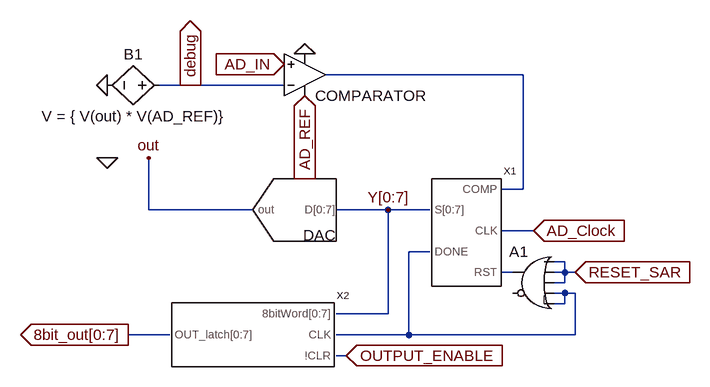
[diagram p0: schematic SAR.asc]
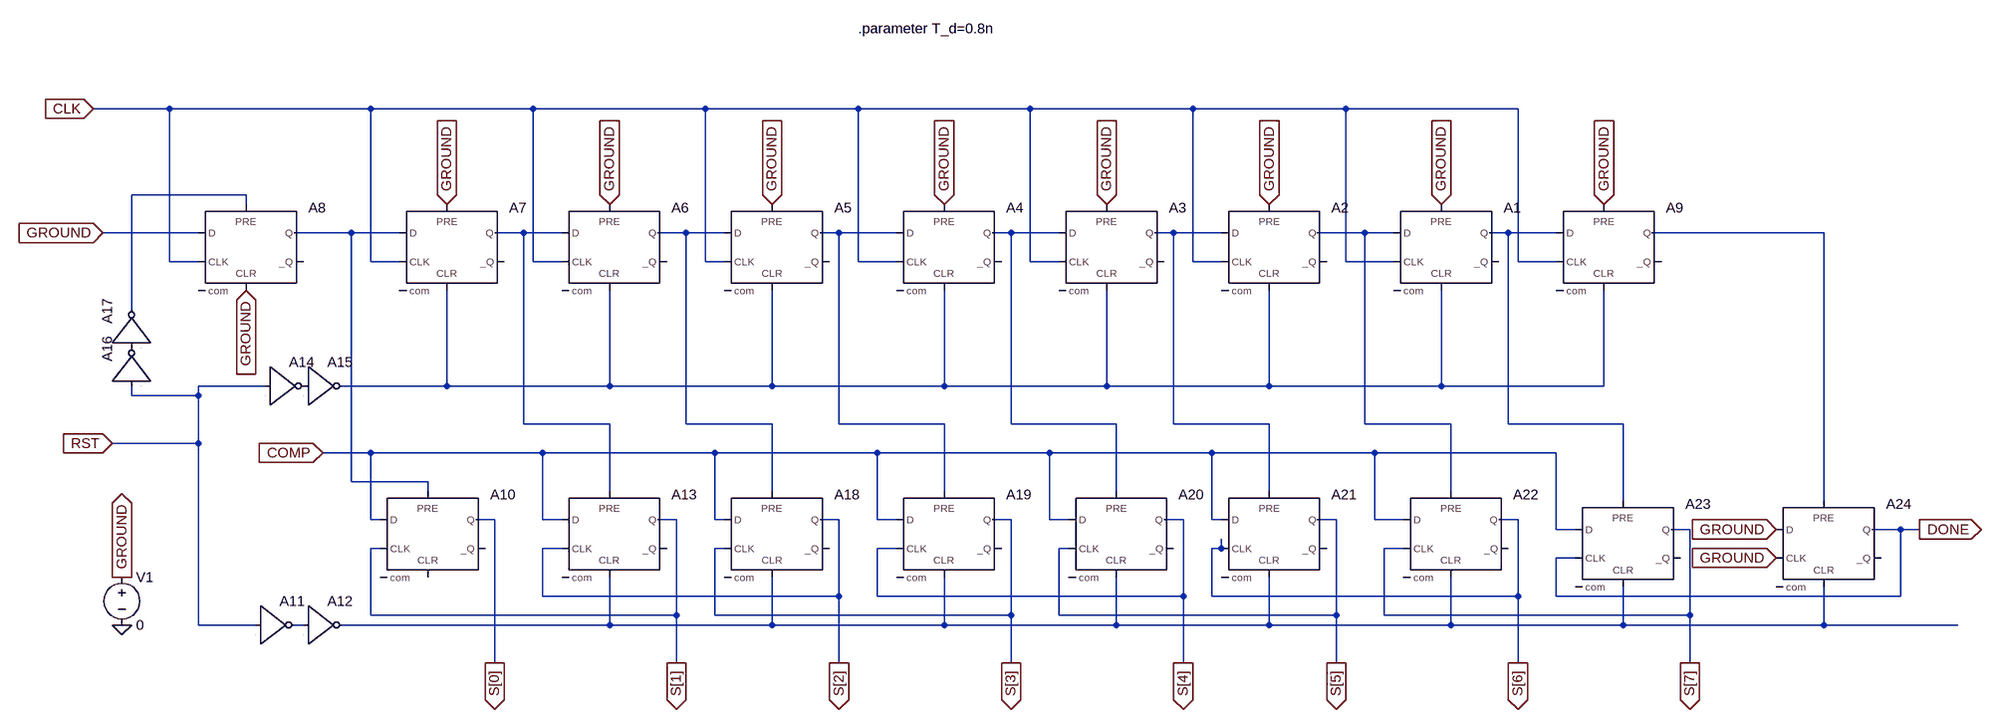
[diagram p1: sub-circuit sar_logic.asc]
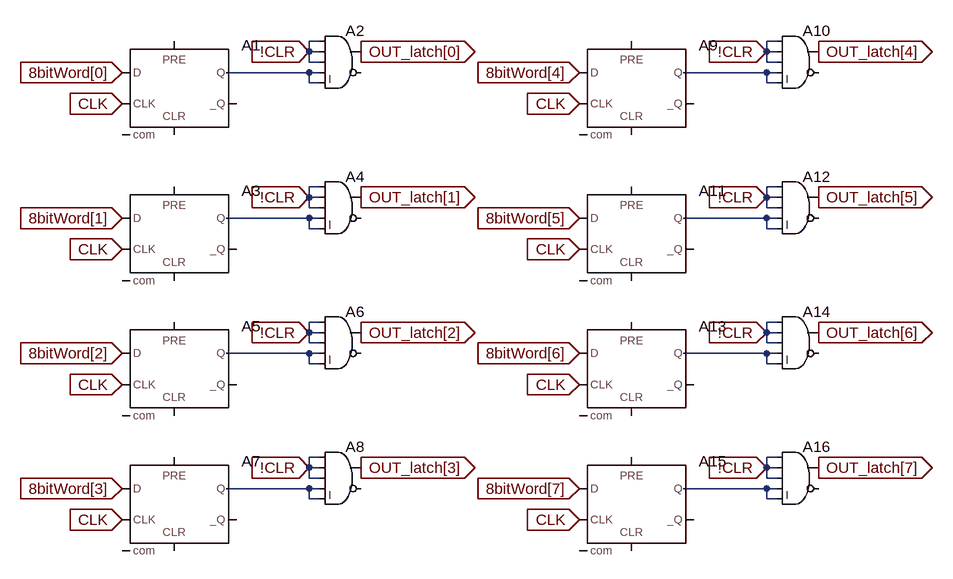
[diagram p2: sub-circuit latch_8bit.asc]
SAR.asc, the LTspice schematic file:
Version 4
SHEET 1 880 680
WIRE -176 -112 -480 -112
WIRE -688 -96 -736 -96
WIRE -544 -96 -688 -96
WIRE -176 64 -176 -112
WIRE -176 64 -208 64
WIRE -752 96 -752 16
WIRE -592 96 -752 96
WIRE -384 96 -464 96
WIRE -320 96 -384 96
WIRE -160 128 -208 128
WIRE -320 160 -352 160
WIRE -112 176 -128 176
WIRE -192 192 -208 192
WIRE -112 192 -112 176
WIRE -112 192 -128 192
WIRE -96 192 -112 192
WIRE -112 208 -112 192
WIRE -112 208 -128 208
WIRE -112 224 -128 224
WIRE -96 224 -112 224
WIRE -112 240 -112 224
WIRE -112 240 -128 240
WIRE -384 256 -384 96
WIRE -384 256 -464 256
WIRE -720 288 -784 288
WIRE -352 288 -352 160
WIRE -352 288 -464 288
WIRE -96 288 -96 224
WIRE -96 288 -352 288
WIRE -448 320 -464 320
FLAG -544 -128 AD_IN
IOPIN -544 -128 In
FLAG -512 -144 0
FLAG -512 -80 AD_REF
IOPIN -512 -80 In
FLAG -384 96 Y[0:7]
FLAG -784 288 8bit_out[0:7]
IOPIN -784 288 Out
FLAG -448 320 OUTPUT_ENABLE
IOPIN -448 320 In
FLAG -160 128 AD_Clock
IOPIN -160 128 In
FLAG -96 192 RESET_SAR
IOPIN -96 192 In
FLAG -688 -96 debug
IOPIN -688 -96 Out
FLAG -816 -96 0
FLAG -752 16 out
FLAG -816 16 0
SYMBOL Opamps\\UniversalOpamp2 -512 -112 M180
SYMATTR InstName COMPARATOR
SYMBOL DAC8 -528 96 R180
SYMATTR InstName DAC
SYMATTR SpiceModel DAC8
SYMBOL SAR_LOGIC -256 128 R0
SYMATTR InstName X1
SYMBOL Latch_8bit -576 288 R0
SYMATTR InstName X2
SYMBOL bv -720 -96 R90
WINDOW 0 -32 56 VBottom 2
WINDOW 3 32 56 VTop 2
SYMATTR InstName B1
SYMATTR Value V = { V(out) * V(AD_REF)}
SYMBOL Digital\\or -160 144 M0
SYMATTR InstName A1

sar_logic.asc, the sub-circuit schematic file:
Version 4
SHEET 1 1752 752
WIRE -1664 -368 -1792 -368
WIRE -1328 -368 -1664 -368
WIRE -1056 -368 -1328 -368
WIRE -768 -368 -1056 -368
WIRE -512 -368 -768 -368
WIRE -224 -368 -512 -368
WIRE 48 -368 -224 -368
WIRE 304 -368 48 -368
WIRE 592 -368 304 -368
WIRE -1536 -224 -1728 -224
WIRE -1536 -208 -1536 -224
WIRE -1616 -160 -1776 -160
WIRE -1360 -160 -1456 -160
WIRE -1280 -160 -1360 -160
WIRE -1072 -160 -1120 -160
WIRE -1008 -160 -1072 -160
WIRE -800 -160 -848 -160
WIRE -736 -160 -800 -160
WIRE -544 -160 -576 -160
WIRE -448 -160 -544 -160
WIRE -256 -160 -288 -160
WIRE -176 -160 -256 -160
WIRE 16 -160 -16 -160
WIRE 96 -160 16 -160
WIRE 336 -160 256 -160
WIRE 384 -160 336 -160
WIRE 576 -160 544 -160
WIRE 656 -160 576 -160
WIRE 1104 -160 816 -160
WIRE -1664 -112 -1664 -368
WIRE -1616 -112 -1664 -112
WIRE -1328 -112 -1328 -368
WIRE -1280 -112 -1328 -112
WIRE -1056 -112 -1056 -368
WIRE -1008 -112 -1056 -112
WIRE -768 -112 -768 -368
WIRE -736 -112 -768 -112
WIRE -512 -112 -512 -368
WIRE -448 -112 -512 -112
WIRE -224 -112 -224 -368
WIRE -176 -112 -224 -112
WIRE 48 -112 48 -368
WIRE 96 -112 48 -112
WIRE 304 -112 304 -368
WIRE 384 -112 304 -112
WIRE 592 -112 592 -368
WIRE 656 -112 592 -112
WIRE -1728 -32 -1728 -224
WIRE -1504 96 -1616 96
WIRE -1200 96 -1200 -64
WIRE -1200 96 -1376 96
WIRE -928 96 -928 -64
WIRE -928 96 -1200 96
WIRE -656 96 -656 -64
WIRE -656 96 -928 96
WIRE -368 96 -368 -64
WIRE -368 96 -656 96
WIRE -96 96 -96 -64
WIRE -96 96 -368 96
WIRE 176 96 176 -64
WIRE 176 96 -96 96
WIRE 464 96 464 -64
WIRE 464 96 176 96
WIRE 736 96 736 -64
WIRE 736 96 464 96
WIRE -1728 112 -1728 96
WIRE -1616 112 -1616 96
WIRE -1616 112 -1728 112
WIRE -1072 160 -1072 -160
WIRE -928 160 -1072 160
WIRE -800 160 -800 -160
WIRE -656 160 -800 160
WIRE -544 160 -544 -160
WIRE -368 160 -544 160
WIRE -256 160 -256 -160
WIRE -80 160 -256 160
WIRE 16 160 16 -160
WIRE 176 160 16 160
WIRE 336 160 336 -160
WIRE 480 160 336 160
WIRE 576 160 576 -160
WIRE 768 160 576 160
WIRE -1616 192 -1616 112
WIRE -1616 192 -1760 192
WIRE -1328 208 -1408 208
WIRE -1040 208 -1328 208
WIRE -752 208 -1040 208
WIRE -480 208 -752 208
WIRE -192 208 -480 208
WIRE 80 208 -192 208
WIRE 352 208 80 208
WIRE 656 208 352 208
WIRE -1360 256 -1360 -160
WIRE -1232 256 -1360 256
WIRE -1232 272 -1232 256
WIRE -928 272 -928 160
WIRE -656 272 -656 160
WIRE -368 272 -368 160
WIRE -80 272 -80 160
WIRE 176 272 176 160
WIRE 480 272 480 160
WIRE 768 288 768 160
WIRE 1104 288 1104 -160
WIRE -1328 320 -1328 208
WIRE -1312 320 -1328 320
WIRE -1120 320 -1152 320
WIRE -1040 320 -1040 208
WIRE -1008 320 -1040 320
WIRE -816 320 -848 320
WIRE -752 320 -752 208
WIRE -736 320 -752 320
WIRE -544 320 -576 320
WIRE -480 320 -480 208
WIRE -448 320 -480 320
WIRE -256 320 -288 320
WIRE -192 320 -192 208
WIRE -160 320 -192 320
WIRE 32 320 0 320
WIRE 80 320 80 208
WIRE 96 320 80 320
WIRE 288 320 256 320
WIRE 352 320 352 208
WIRE 400 320 352 320
WIRE 592 320 560 320
WIRE 656 336 656 208
WIRE 688 336 656 336
WIRE 880 336 848 336
WIRE 1232 336 1184 336
WIRE 1264 336 1232 336
WIRE -1312 368 -1328 368
WIRE -1008 368 -1040 368
WIRE -736 368 -752 368
WIRE -448 368 -480 368
WIRE -160 368 -176 368
WIRE 96 368 96 352
WIRE 96 368 80 368
WIRE 400 368 368 368
WIRE 688 384 656 384
WIRE -1040 448 -1040 368
WIRE -544 448 -544 320
WIRE -544 448 -1040 448
WIRE -480 448 -480 368
WIRE 32 448 32 320
WIRE 32 448 -480 448
WIRE 80 448 80 368
WIRE 592 448 592 320
WIRE 592 448 80 448
WIRE 656 448 656 384
WIRE 1232 448 1232 336
WIRE 1232 448 656 448
WIRE -1328 480 -1328 368
WIRE -816 480 -816 320
WIRE -816 480 -1328 480
WIRE -752 480 -752 368
WIRE -256 480 -256 320
WIRE -256 480 -752 480
WIRE -176 480 -176 368
WIRE 288 480 288 320
WIRE 288 480 -176 480
WIRE 368 480 368 368
WIRE 880 480 880 336
WIRE 880 480 368 480
WIRE -1616 496 -1616 192
WIRE -1520 496 -1616 496
WIRE -1440 496 -1456 496
WIRE -928 496 -928 416
WIRE -928 496 -1376 496
WIRE -656 496 -656 416
WIRE -656 496 -928 496
WIRE -368 496 -368 416
WIRE -368 496 -656 496
WIRE -80 496 -80 416
WIRE -80 496 -368 496
WIRE 176 496 176 416
WIRE 176 496 -80 496
WIRE 480 496 480 416
WIRE 480 496 176 496
WIRE 768 496 768 432
WIRE 768 496 480 496
WIRE 1104 496 1104 432
WIRE 1104 496 768 496
WIRE 1328 496 1104 496
WIRE -1120 560 -1120 320
WIRE -816 560 -816 480
WIRE -544 560 -544 448
WIRE -256 560 -256 480
WIRE 32 560 32 448
WIRE 288 560 288 480
WIRE 592 560 592 448
WIRE 880 560 880 480
FLAG -1408 208 COMP
IOPIN -1408 208 In
FLAG -1792 -368 CLK
IOPIN -1792 -368 In
FLAG -1760 192 RST
IOPIN -1760 192 In
FLAG 1264 336 DONE
IOPIN 1264 336 Out
FLAG 880 560 S[7]
IOPIN 880 560 Out
FLAG 592 560 S[6]
IOPIN 592 560 Out
FLAG 288 560 S[5]
IOPIN 288 560 Out
FLAG 32 560 S[4]
IOPIN 32 560 Out
FLAG -256 560 S[3]
IOPIN -256 560 Out
FLAG -544 560 S[2]
IOPIN -544 560 Out
FLAG -816 560 S[1]
IOPIN -816 560 Out
FLAG -1120 560 S[0]
IOPIN -1120 560 Out
FLAG -1744 496 0
FLAG -1744 416 GROUND
IOPIN -1744 416 Out
FLAG -1776 -160 GROUND
IOPIN -1776 -160 In
FLAG -1200 -208 GROUND
IOPIN -1200 -208 In
FLAG -928 -208 GROUND
IOPIN -928 -208 In
FLAG -656 -208 GROUND
IOPIN -656 -208 In
FLAG -368 -208 GROUND
IOPIN -368 -208 In
FLAG -96 -208 GROUND
IOPIN -96 -208 In
FLAG 176 -208 GROUND
IOPIN 176 -208 In
FLAG 464 -208 GROUND
IOPIN 464 -208 In
FLAG 736 -208 GROUND
IOPIN 736 -208 In
FLAG -1536 -64 GROUND
IOPIN -1536 -64 In
FLAG 1024 336 GROUND
IOPIN 1024 336 In
FLAG 1024 384 GROUND
IOPIN 1024 384 In
SYMBOL voltage -1744 400 R0
SYMATTR InstName V1
SYMATTR Value 0
SYMBOL Digital\\dflop 736 -208 R0
SYMATTR InstName A9
SYMATTR SpiceLine td={T_d}
SYMBOL Digital\\inv -1520 432 R0
SYMATTR InstName A11
SYMATTR SpiceLine td = 1p
SYMBOL Digital\\inv -1440 432 R0
SYMATTR InstName A12
SYMATTR SpiceLine td=1p
SYMBOL Digital\\inv -1504 32 R0
SYMATTR InstName A14
SYMATTR SpiceLine td=1p
SYMBOL Digital\\inv -1440 32 R0
SYMATTR InstName A15
SYMATTR SpiceLine td=1p
SYMBOL Digital\\inv -1792 96 R270
SYMATTR InstName A16
SYMATTR SpiceLine td=1p
SYMBOL Digital\\inv -1792 32 R270
SYMATTR InstName A17
SYMATTR SpiceLine td=1p
SYMBOL Digital\\dflop 464 -208 R0
SYMATTR InstName A1
SYMATTR SpiceLine td={T_d}
SYMBOL Digital\\dflop 176 -208 R0
SYMATTR InstName A2
SYMATTR SpiceLine td={T_d}
SYMBOL Digital\\dflop -96 -208 R0
SYMATTR InstName A3
SYMATTR SpiceLine td={T_d}
SYMBOL Digital\\dflop -368 -208 R0
SYMATTR InstName A4
SYMATTR SpiceLine td={T_d}
SYMBOL Digital\\dflop -656 -208 R0
SYMATTR InstName A5
SYMATTR SpiceLine td={T_d}
SYMBOL Digital\\dflop -928 -208 R0
SYMATTR InstName A6
SYMATTR SpiceLine td={T_d}
SYMBOL Digital\\dflop -1200 -208 R0
SYMATTR InstName A7
SYMATTR SpiceLine td={T_d}
SYMBOL Digital\\dflop -1536 -208 R0
SYMATTR InstName A8
SYMATTR SpiceLine td={T_d}
SYMBOL Digital\\dflop -1232 272 R0
SYMATTR InstName A10
SYMATTR SpiceLine td={T_d}
SYMBOL Digital\\dflop -928 272 R0
SYMATTR InstName A13
SYMATTR SpiceLine td={T_d}
SYMBOL Digital\\dflop -656 272 R0
SYMATTR InstName A18
SYMATTR SpiceLine td={T_d}
SYMBOL Digital\\dflop -368 272 R0
SYMATTR InstName A19
SYMATTR SpiceLine td={T_d}
SYMBOL Digital\\dflop -80 272 R0
SYMATTR InstName A20
SYMATTR SpiceLine td={T_d}
SYMBOL Digital\\dflop 176 272 R0
SYMATTR InstName A21
SYMATTR SpiceLine td={T_d}
SYMBOL Digital\\dflop 480 272 R0
SYMATTR InstName A22
SYMATTR SpiceLine td={T_d}
SYMBOL Digital\\dflop 768 288 R0
SYMATTR InstName A23
SYMATTR SpiceLine td={T_d}
SYMBOL Digital\\dflop 1104 288 R0
SYMATTR InstName A24
SYMATTR SpiceLine td={T_d}
TEXT -512 -504 Left 2 !.parameter T_d=0.8n

latch_8bit.asc, the sub-circuit schematic file:
Version 4
SHEET 1 1284 920
WIRE 272 80 256 80
WIRE 976 80 960 80
WIRE 256 96 256 80
WIRE 272 96 256 96
WIRE 960 96 960 80
WIRE 976 96 960 96
WIRE 256 112 256 96
WIRE 272 112 256 112
WIRE 960 112 960 96
WIRE 976 112 960 112
WIRE 256 128 128 128
WIRE 272 128 256 128
WIRE 960 128 832 128
WIRE 976 128 960 128
WIRE 256 144 256 128
WIRE 272 144 256 144
WIRE 960 144 960 128
WIRE 976 144 960 144
WIRE 272 304 256 304
WIRE 976 304 960 304
WIRE 256 320 256 304
WIRE 272 320 256 320
WIRE 960 320 960 304
WIRE 976 320 960 320
WIRE 256 336 256 320
WIRE 272 336 256 336
WIRE 960 336 960 320
WIRE 976 336 960 336
WIRE 256 352 128 352
WIRE 272 352 256 352
WIRE 960 352 832 352
WIRE 976 352 960 352
WIRE 256 368 256 352
WIRE 272 368 256 368
WIRE 960 368 960 352
WIRE 976 368 960 368
WIRE 272 512 256 512
WIRE 976 512 960 512
WIRE 256 528 256 512
WIRE 272 528 256 528
WIRE 960 528 960 512
WIRE 976 528 960 528
WIRE 256 544 256 528
WIRE 272 544 256 544
WIRE 960 544 960 528
WIRE 976 544 960 544
WIRE 256 560 128 560
WIRE 272 560 256 560
WIRE 960 560 832 560
WIRE 976 560 960 560
WIRE 256 576 256 560
WIRE 272 576 256 576
WIRE 960 576 960 560
WIRE 976 576 960 576
WIRE 272 720 256 720
WIRE 976 720 960 720
WIRE 256 736 256 720
WIRE 272 736 256 736
WIRE 960 736 960 720
WIRE 976 736 960 736
WIRE 256 752 256 736
WIRE 272 752 256 752
WIRE 960 752 960 736
WIRE 976 752 960 752
WIRE 256 768 128 768
WIRE 272 768 256 768
WIRE 960 768 832 768
WIRE 976 768 960 768
WIRE 256 784 256 768
WIRE 272 784 256 784
WIRE 960 784 960 768
WIRE 976 784 960 784
FLAG 256 96 !CLR
IOPIN 256 96 In
FLAG 336 96 OUT_latch[0]
IOPIN 336 96 Out
FLAG -32 176 CLK
IOPIN -32 176 In
FLAG -32 128 8bitWord[0]
IOPIN -32 128 In
FLAG 256 320 !CLR
IOPIN 256 320 In
FLAG 336 320 OUT_latch[1]
IOPIN 336 320 Out
FLAG -32 400 CLK
IOPIN -32 400 In
FLAG -32 352 8bitWord[1]
IOPIN -32 352 In
FLAG 256 528 !CLR
IOPIN 256 528 In
FLAG 336 528 OUT_latch[2]
IOPIN 336 528 Out
FLAG -32 608 CLK
IOPIN -32 608 In
FLAG -32 560 8bitWord[2]
IOPIN -32 560 In
FLAG 256 736 !CLR
IOPIN 256 736 In
FLAG 336 736 OUT_latch[3]
IOPIN 336 736 Out
FLAG -32 816 CLK
IOPIN -32 816 In
FLAG -32 768 8bitWord[3]
IOPIN -32 768 In
FLAG 960 96 !CLR
IOPIN 960 96 In
FLAG 1040 96 OUT_latch[4]
IOPIN 1040 96 Out
FLAG 672 176 CLK
IOPIN 672 176 In
FLAG 672 128 8bitWord[4]
IOPIN 672 128 In
FLAG 960 320 !CLR
IOPIN 960 320 In
FLAG 1040 320 OUT_latch[5]
IOPIN 1040 320 Out
FLAG 672 400 CLK
IOPIN 672 400 In
FLAG 672 352 8bitWord[5]
IOPIN 672 352 In
FLAG 960 528 !CLR
IOPIN 960 528 In
FLAG 1040 528 OUT_latch[6]
IOPIN 1040 528 Out
FLAG 672 608 CLK
IOPIN 672 608 In
FLAG 672 560 8bitWord[6]
IOPIN 672 560 In
FLAG 960 736 !CLR
IOPIN 960 736 In
FLAG 1040 736 OUT_latch[7]
IOPIN 1040 736 Out
FLAG 672 816 CLK
IOPIN 672 816 In
FLAG 672 768 8bitWord[7]
IOPIN 672 768 In
SYMBOL Digital\\dflop 48 80 R0
SYMATTR InstName A1
SYMATTR SpiceLine td=11n
SYMBOL Digital\\and 304 48 R0
SYMATTR InstName A2
SYMBOL Digital\\and 304 272 R0
SYMATTR InstName A4
SYMBOL Digital\\and 304 480 R0
SYMATTR InstName A6
SYMBOL Digital\\and 304 688 R0
SYMATTR InstName A8
SYMBOL Digital\\and 1008 48 R0
SYMATTR InstName A10
SYMBOL Digital\\and 1008 272 R0
SYMATTR InstName A12
SYMBOL Digital\\and 1008 480 R0
SYMATTR InstName A14
SYMBOL Digital\\and 1008 688 R0
SYMATTR InstName A16
SYMBOL Digital\\dflop 48 304 R0
SYMATTR InstName A3
SYMATTR SpiceLine td=11n
SYMBOL Digital\\dflop 48 512 R0
SYMATTR InstName A5
SYMATTR SpiceLine td=11n
SYMBOL Digital\\dflop 48 720 R0
SYMATTR InstName A7
SYMATTR SpiceLine td=11n
SYMBOL Digital\\dflop 752 80 R0
SYMATTR InstName A9
SYMATTR SpiceLine td=11n
SYMBOL Digital\\dflop 752 304 R0
SYMATTR InstName A11
SYMATTR SpiceLine td=11n
SYMBOL Digital\\dflop 752 512 R0
SYMATTR InstName A13
SYMATTR SpiceLine td=11n
SYMBOL Digital\\dflop 752 720 R0
SYMATTR InstName A15
SYMATTR SpiceLine td=11n

The netlist it stands for:
* SAR.asc
XCOMPARATOR AD_IN debug AD_REF 0 N001 level.2 Avol=1Meg GBW=10Meg Slew=10Meg ilimit=25m rail=0 Vos=0 phimargin=45 en=0 enk=0 in=0 ink=0 Rin=500Meg  ; pins IN+ IN- V+ V- OUT
XDAC Y[0] Y[1] Y[2] Y[3] Y[4] Y[5] Y[6] Y[7] out DAC8 Vhigh=1 Vlow=0 Vt=0.5  ; pins D[0:7] out
XX1 Y[0] Y[1] Y[2] Y[3] Y[4] Y[5] Y[6] Y[7] N002 N001 AD_Clock N003 sar_logic
XX2 8bit_out[0] 8bit_out[1] 8bit_out[2] 8bit_out[3] 8bit_out[4] 8bit_out[5] 8bit_out[6] 8bit_out[7] Y[0] Y[1] Y[2] Y[3] Y[4] Y[5] Y[6] Y[7] N002 OUTPUT_ENABLE latch_8bit
B1 debug 0 V = { V(out) * V(AD_REF)}
A1 RESET_SAR RESET_SAR RESET_SAR N002 N002 0 N003 0 OR

* block symbol definitions
.subckt sar_logic S[0] S[1] S[2] S[3] S[4] S[5] S[6] S[7] DONE COMP CLK RST
V1 GROUND 0 0
A9 N009 0 CLK GROUND N011 0 N010 0 DFLOP td={T_d}
A11 RST 0 0 0 0 N012 0 0 BUF td = 1p
A12 N012 0 0 0 0 N013 0 0 BUF td=1p
A14 RST 0 0 0 0 P001 0 0 BUF td=1p
A15 P001 0 0 0 0 N011 0 0 BUF td=1p
A16 RST 0 0 0 0 P002 0 0 BUF td=1p
A17 P002 0 0 0 0 N001 0 0 BUF td=1p
A1 N008 0 CLK GROUND N011 0 N009 0 DFLOP td={T_d}
A2 N007 0 CLK GROUND N011 0 N008 0 DFLOP td={T_d}
A3 N006 0 CLK GROUND N011 0 N007 0 DFLOP td={T_d}
A4 N005 0 CLK GROUND N011 0 N006 0 DFLOP td={T_d}
A5 N004 0 CLK GROUND N011 0 N005 0 DFLOP td={T_d}
A6 N003 0 CLK GROUND N011 0 N004 0 DFLOP td={T_d}
A7 N002 0 CLK GROUND N011 0 N003 0 DFLOP td={T_d}
A8 GROUND 0 CLK N001 GROUND 0 N002 0 DFLOP td={T_d}
A10 COMP 0 S[1] N002 0 0 S[0] 0 DFLOP td={T_d}
A13 COMP 0 S[2] N003 N013 0 S[1] 0 DFLOP td={T_d}
A18 COMP 0 S[3] N004 N013 0 S[2] 0 DFLOP td={T_d}
A19 COMP 0 S[4] N005 N013 0 S[3] 0 DFLOP td={T_d}
A20 COMP 0 S[5] N006 N013 0 S[4] 0 DFLOP td={T_d}
A21 COMP 0 S[6] N007 N013 0 S[5] 0 DFLOP td={T_d}
A22 COMP 0 S[7] N008 N013 0 S[6] 0 DFLOP td={T_d}
A23 COMP 0 DONE N009 N013 0 S[7] 0 DFLOP td={T_d}
A24 GROUND 0 GROUND N010 N013 0 DONE 0 DFLOP td={T_d}
.parameter T_d=0.8n
.ends sar_logic

.subckt latch_8bit OUT_latch[0] OUT_latch[1] OUT_latch[2] OUT_latch[3] OUT_latch[4] OUT_latch[5] OUT_latch[6] OUT_latch[7] 8bitWord[0] 8bitWord[1] 8bitWord[2] 8bitWord[3] 8bitWord[4] 8bitWord[5] 8bitWord[6] 8bitWord[7] CLK !CLR
A1 8bitWord[0] 0 CLK 0 0 0 N001 0 DFLOP td=11n
A2 !CLR !CLR !CLR N001 N001 0 OUT_latch[0] 0 AND
A4 !CLR !CLR !CLR N003 N003 0 OUT_latch[1] 0 AND
A6 !CLR !CLR !CLR N005 N005 0 OUT_latch[2] 0 AND
A8 !CLR !CLR !CLR N007 N007 0 OUT_latch[3] 0 AND
A10 !CLR !CLR !CLR N002 N002 0 OUT_latch[4] 0 AND
A12 !CLR !CLR !CLR N004 N004 0 OUT_latch[5] 0 AND
A14 !CLR !CLR !CLR N006 N006 0 OUT_latch[6] 0 AND
A16 !CLR !CLR !CLR N008 N008 0 OUT_latch[7] 0 AND
A3 8bitWord[1] 0 CLK 0 0 0 N003 0 DFLOP td=11n
A5 8bitWord[2] 0 CLK 0 0 0 N005 0 DFLOP td=11n
A7 8bitWord[3] 0 CLK 0 0 0 N007 0 DFLOP td=11n
A9 8bitWord[4] 0 CLK 0 0 0 N002 0 DFLOP td=11n
A11 8bitWord[5] 0 CLK 0 0 0 N004 0 DFLOP td=11n
A13 8bitWord[6] 0 CLK 0 0 0 N006 0 DFLOP td=11n
A15 8bitWord[7] 0 CLK 0 0 0 N008 0 DFLOP td=11n
.ends latch_8bit

.lib UniversalOpamps2.sub
.backanno
.end